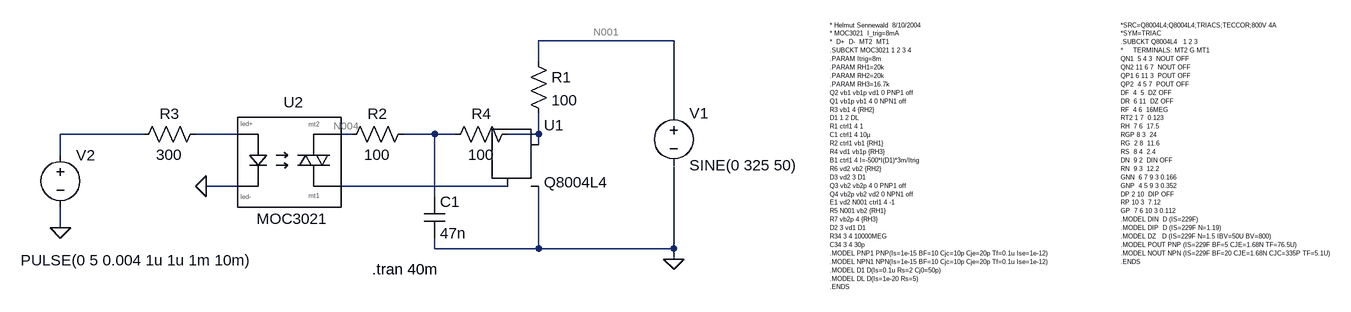
[diagram p0: schematic Triac circuit.asc]
Triac circuit.asc, the LTspice schematic file:
Version 4
SHEET 1 1132 824
WIRE -288 -96 -496 -96
WIRE -496 -64 -496 -96
WIRE -288 16 -288 -96
WIRE -1104 48 -1232 48
WIRE -960 48 -1024 48
WIRE -784 48 -800 48
WIRE -656 48 -704 48
WIRE -624 48 -656 48
WIRE -496 48 -496 16
WIRE -496 48 -544 48
WIRE -496 64 -496 48
WIRE -1232 80 -1232 48
WIRE -960 128 -1008 128
WIRE -544 128 -800 128
WIRE -656 144 -656 48
WIRE -1232 192 -1232 160
WIRE -656 224 -656 208
WIRE -496 224 -496 128
WIRE -496 224 -656 224
WIRE -288 224 -288 96
WIRE -288 224 -496 224
WIRE -288 240 -288 224
FLAG -288 240 0
FLAG -1232 192 0
FLAG -1008 128 0
SYMBOL Misc\\TRIAC -528 64 R0
SYMATTR InstName U1
SYMATTR Value Q8004L4
SYMBOL res -512 -80 R0
SYMATTR InstName R1
SYMATTR Value 100
SYMBOL res -800 64 R270
WINDOW 0 32 56 VTop 2
WINDOW 3 0 56 VBottom 2
SYMATTR InstName R2
SYMATTR Value 100
SYMBOL voltage -288 0 R0
WINDOW 123 0 0 Left 0
WINDOW 39 0 0 Left 0
SYMATTR InstName V1
SYMATTR Value SINE(0 325 50)
SYMBOL LED_TRIAC -912 64 R0
WINDOW 38 32 112 Invisible 0
WINDOW 0 39 -65 Center 2
WINDOW 3 37 114 Center 2
SYMATTR SpiceModel ""
SYMATTR InstName U2
SYMATTR Value MOC3021
SYMBOL res -1120 64 R270
WINDOW 0 32 56 VTop 2
WINDOW 3 0 56 VBottom 2
SYMATTR InstName R3
SYMATTR Value 300
SYMBOL voltage -1232 64 R0
WINDOW 3 -61 178 Left 2
WINDOW 123 0 0 Left 0
WINDOW 39 0 0 Left 0
SYMATTR Value PULSE(0 5 0.004 1u 1u 1m 10m)
SYMATTR InstName V2
SYMBOL res -640 64 R270
WINDOW 0 32 56 VTop 2
WINDOW 3 0 56 VBottom 2
SYMATTR InstName R4
SYMATTR Value 100
SYMBOL cap -672 144 R0
SYMATTR InstName C1
SYMATTR Value 47n
TEXT 400 -120 Left 0 !*SRC=Q8004L4;Q8004L4;TRIACS;TECCOR;800V 4A\n*SYM=TRIAC\n.SUBCKT Q8004L4   1 2 3\n*     TERMINALS: MT2 G MT1\nQN1  5 4 3  NOUT OFF\nQN2 11 6 7  NOUT OFF\nQP1 6 11 3  POUT OFF\nQP2  4 5 7  POUT OFF\nDF  4  5  DZ OFF\nDR  6 11  DZ OFF\nRF  4 6  16MEG\nRT2 1 7  0.123\nRH  7 6  17.5\nRGP 8 3  24\nRG  2 8  11.6\nRS  8 4  2.4\nDN  9 2  DIN OFF\nRN  9 3  12.2\nGNN  6 7 9 3 0.166\nGNP  4 5 9 3 0.352\nDP 2 10  DIP OFF\nRP 10 3  7.12\nGP  7 6 10 3 0.112\n.MODEL DIN  D (IS=229F)\n.MODEL DIP  D (IS=229F N=1.19)\n.MODEL DZ   D (IS=229F N=1.5 IBV=50U BV=800)\n.MODEL POUT PNP (IS=229F BF=5 CJE=1.68N TF=76.5U)\n.MODEL NOUT NPN (IS=229F BF=20 CJE=1.68N CJC=335P TF=5.1U)\n.ENDS
TEXT -48 -120 Left 0 !* Helmut Sennewald  8/10/2004\n* MOC3021  I_trig=8mA\n*  D+  D-  MT2  MT1\n.SUBCKT MOC3021 1 2 3 4\n.PARAM Itrig=8m\n.PARAM RH1=20k\n.PARAM RH2=20k\n.PARAM RH3=16.7k\nQ2 vb1 vb1p vd1 0 PNP1 off\nQ1 vb1p vb1 4 0 NPN1 off\nR3 vb1 4 {RH2}\nD1 1 2 DL\nR1 ctrl1 4 1\nC1 ctrl1 4 10µ\nR2 ctrl1 vb1 {RH1}\nR4 vd1 vb1p {RH3}\nB1 ctrl1 4 I=-500*I(D1)*3m/Itrig \nR6 vd2 vb2 {RH2}\nD3 vd2 3 D1\nQ3 vb2 vb2p 4 0 PNP1 off\nQ4 vb2p vb2 vd2 0 NPN1 off\nE1 vd2 N001 ctrl1 4 -1\nR5 N001 vb2 {RH1}\nR7 vb2p 4 {RH3}\nD2 3 vd1 D1\nR34 3 4 10000MEG\nC34 3 4 30p\n.MODEL PNP1 PNP(Is=1e-15 BF=10 Cjc=10p Cje=20p Tf=0.1u Ise=1e-12)\n.MODEL NPN1 NPN(Is=1e-15 BF=10 Cjc=10p Cje=20p Tf=0.1u Ise=1e-12)\n.MODEL D1 D(Is=0.1u Rs=2 Cj0=50p)\n.MODEL DL D(Is=1e-20 Rs=5)\n.ENDS
TEXT -752 256 Left 2 !.tran 40m

The netlist it stands for:
* Triac circuit.asc
XU1 N006 N007 0 Q8004L4  ; pins MT2 G MT1
R1 N001 N006 100
R2 N004 N005 100
V1 N001 0 SINE(0 325 50)
XU2 N003 0 N004 N007 MOC3021  ; pins led+ led- mt2 mt1
R3 N002 N003 300
V2 N002 0 PULSE(0 5 0.004 1u 1u 1m 10m)
R4 N005 N006 100
C1 N005 0 47n
*SRC=Q8004L4;Q8004L4;TRIACS;TECCOR;800V 4A
*SYM=TRIAC
.SUBCKT Q8004L4   1 2 3
*     TERMINALS: MT2 G MT1
QN1  5 4 3  NOUT OFF
QN2 11 6 7  NOUT OFF
QP1 6 11 3  POUT OFF
QP2  4 5 7  POUT OFF
DF  4  5  DZ OFF
DR  6 11  DZ OFF
RF  4 6  16MEG
RT2 1 7  0.123
RH  7 6  17.5
RGP 8 3  24
RG  2 8  11.6
RS  8 4  2.4
DN  9 2  DIN OFF
RN  9 3  12.2
GNN  6 7 9 3 0.166
GNP  4 5 9 3 0.352
DP 2 10  DIP OFF
RP 10 3  7.12
GP  7 6 10 3 0.112
.MODEL DIN  D (IS=229F)
.MODEL DIP  D (IS=229F N=1.19)
.MODEL DZ   D (IS=229F N=1.5 IBV=50U BV=800)
.MODEL POUT PNP (IS=229F BF=5 CJE=1.68N TF=76.5U)
.MODEL NOUT NPN (IS=229F BF=20 CJE=1.68N CJC=335P TF=5.1U)
.ENDS
* Helmut Sennewald  8/10/2004
* MOC3021  I_trig=8mA
*  D+  D-  MT2  MT1
.SUBCKT MOC3021 1 2 3 4
.PARAM Itrig=8m
.PARAM RH1=20k
.PARAM RH2=20k
.PARAM RH3=16.7k
Q2 vb1 vb1p vd1 0 PNP1 off
Q1 vb1p vb1 4 0 NPN1 off
R3 vb1 4 {RH2}
D1 1 2 DL
R1 ctrl1 4 1
C1 ctrl1 4 10µ
R2 ctrl1 vb1 {RH1}
R4 vd1 vb1p {RH3}
B1 ctrl1 4 I=-500*I(D1)*3m/Itrig
R6 vd2 vb2 {RH2}
D3 vd2 3 D1
Q3 vb2 vb2p 4 0 PNP1 off
Q4 vb2p vb2 vd2 0 NPN1 off
E1 vd2 N001 ctrl1 4 -1
R5 N001 vb2 {RH1}
R7 vb2p 4 {RH3}
D2 3 vd1 D1
R34 3 4 10000MEG
C34 3 4 30p
.MODEL PNP1 PNP(Is=1e-15 BF=10 Cjc=10p Cje=20p Tf=0.1u Ise=1e-12)
.MODEL NPN1 NPN(Is=1e-15 BF=10 Cjc=10p Cje=20p Tf=0.1u Ise=1e-12)
.MODEL D1 D(Is=0.1u Rs=2 Cj0=50p)
.MODEL DL D(Is=1e-20 Rs=5)
.ENDS
.tran 40m
.backanno
.end

* Results of the author's LTspice run, read from the files saved beside the schematic
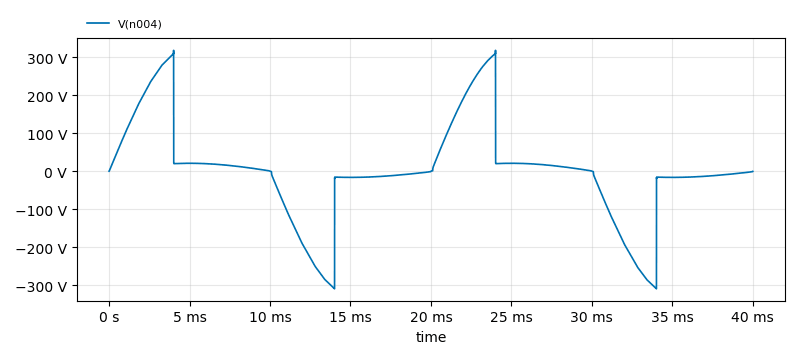
[diagram p1: Transient Analysis of Triac circuit.asc, plotted from the saved traces]
* Transient Analysis, 1 run:
*   V(n004): min -309.2 V, max 317.5 V, average 896.8 mV, rms 127.9 V, last -487.3 mV